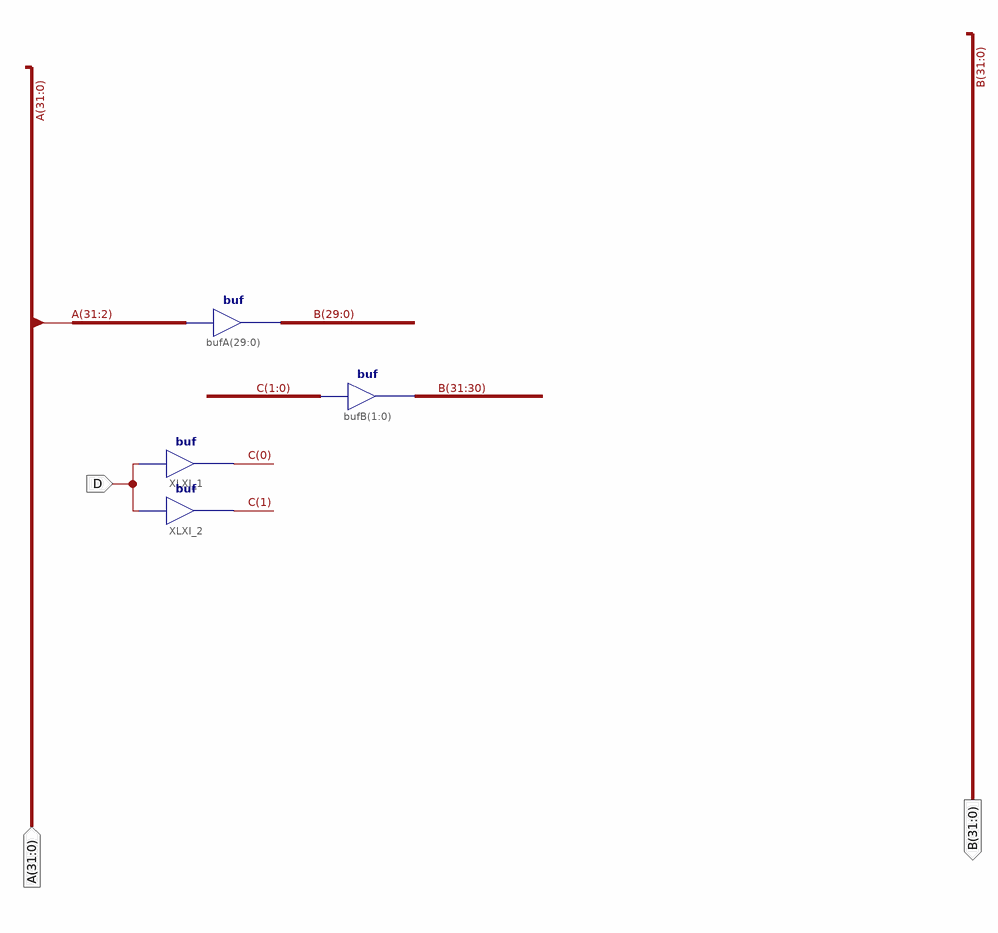
[diagram p0: schematic sheet 1]
// Xilinx ISE schematic shift_2bits.sch (artix7) as structural Verilog: 4 symbols, 3 ports
module shift_2bits (
  input  [31:0] A,
  input  D,
  output [31:0] B
);

  wire [1:0] C;

  assign B[31:30] = C;  // buf bufB[1..0], 2 bits wide
  assign B[29:0] = A[31:2];  // buf bufA[29..0], 30 bits wide
  buf XLXI_1 (C[0], D);
  buf XLXI_2 (C[1], D);
endmodule
